# Altium schematic sheet Arc.SchDoc
size A4
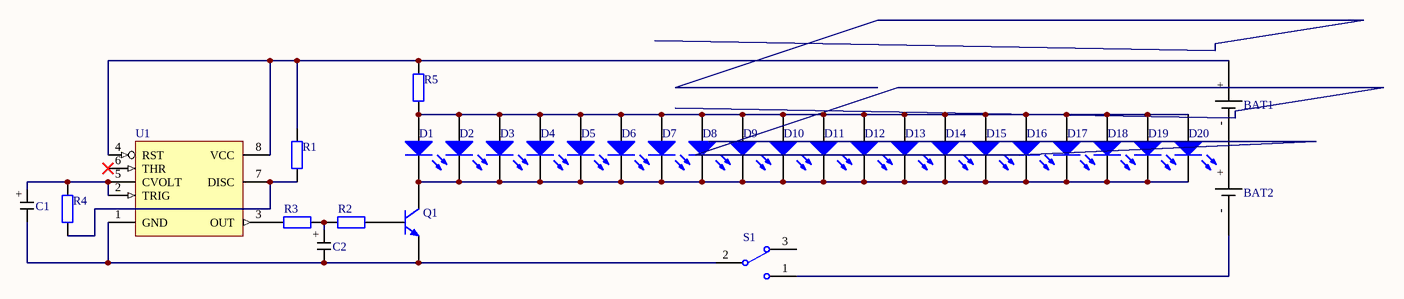
[diagram p0: Arc.SchDoc]

## Parts
BAT1  Power  [CR1220_Dock]  (value not drawn)
BAT2  Power  [CR1220_Dock]  (value not drawn)
C1  Cap  [*CAPCP3528X210N]  (value not drawn)
C2  Cap  [*CAPCP3528X210N]  (value not drawn)
D1  蓝灯 0603  [0603_LED_S1]  (value not drawn)
D2  蓝灯 0603  [0603_LED_S1]  (value not drawn)
D3  蓝灯 0603  [0603_LED_S1]  (value not drawn)
D4  蓝灯 0603  [0603_LED_S1]  (value not drawn)
D5  蓝灯 0603  [0603_LED_S1]  (value not drawn)
D6  蓝灯 0603  [0603_LED_S1]  (value not drawn)
D7  蓝灯 0603  [0603_LED_S1]  (value not drawn)
D8  蓝灯 0603  [0603_LED_S1]  (value not drawn)
D9  蓝灯 0603  [0603_LED_S1]  (value not drawn)
D10  蓝灯 0603  [0603_LED_S1]  (value not drawn)
D11  蓝灯 0603  [0603_LED_S1]  (value not drawn)
D12  蓝灯 0603  [0603_LED_S1]  (value not drawn)
D13  蓝灯 0603  [0603_LED_S1]  (value not drawn)
D14  蓝灯 0603  [0603_LED_S1]  (value not drawn)
D15  蓝灯 0603  [0603_LED_S1]  (value not drawn)
D16  蓝灯 0603  [0603_LED_S1]  (value not drawn)
D17  蓝灯 0603  [0603_LED_S1]  (value not drawn)
D18  蓝灯 0603  [0603_LED_S1]  (value not drawn)
D19  蓝灯 0603  [0603_LED_S1]  (value not drawn)
D20  蓝灯 0603  [0603_LED_S1]  (value not drawn)
Q1  SS8050 Y1  [SOT-23(SOT-23-3)]  (value not drawn)
R1  10KΩ (1002) ±1%  [0603_R]  (value not drawn)
R2  10KΩ (1002) ±1%  [0603_R]  (value not drawn)
R3  47KΩ (4702) ±1%  [0603_R]  (value not drawn)
R4  47KΩ (4702) ±1%  [0603_R]  (value not drawn)
R5  1.6k  [0603_R]  (value not drawn)
S1  SW-SPDT  [sw_9*3.5*5.5mm]  (value not drawn)
U1  NE555DR  [SOIC-8_150mil]  (value not drawn)

## Nets
NetBAT1_+: BAT1.+ R1.2 R5.2 U1.4(RST) U1.8(VCC)
NetBAT1_-: BAT1.- BAT2.+
NetBAT2_-: BAT2.- S1.1
NetC1_+: C1.+ R4.2 U1.2(TRIG) U1.5(CVOLT)
NetC1__: C1._ C2._ Q1.2(E) S1.2 U1.1(GND)
NetC2_+: C2.+ R2.2 R3.2
NetD1_A: D1.A D2.A D3.A D4.A D5.A D6.A D7.A D8.A D9.A D10.A D11.A D12.A D13.A D14.A D15.A D16.A D17.A D18.A D19.A D20.A R5.1
NetD1_K: D1.K D2.K D3.K D4.K D5.K D6.K D7.K D8.K D9.K D10.K D11.K D12.K D13.K D14.K D15.K D16.K D17.K D18.K D19.K D20.K Q1.3(C)
NetQ1_1: Q1.1(B) R2.1
NetR1_1: R1.1 R4.1 U1.7(DISC)
NetR3_1: R3.1 U1.3(OUT)

Not connected (* = marked no-connect by the designer): S1 3; U1 6(THR)*

## Library data of the parts
C1 C2 = Cap: pin to pad: +>1 _>2
D1-D20 = 0603 蓝灯: 发光二极管; ComponentLink1Description: 供应商链接; ComponentLink1URL: http://www.szlcsc.com/product/details_73150.html; Package: 0603; Supplier: LC; SuppliersPartNumber: C72041
Q1 = SOT-23 SS8050 Y1: 三极管; ComponentLink1Description: 供应商链接; ComponentLink1URL: http://www.szlcsc.com/product/details_2507.html; Package: SOT-23; Supplier: LC; SuppliersPartNumber: C2150
R1 R2 = 0603 10KΩ (1002) 1%: 贴片电阻; ComponentLink1Description: 供应商链接; ComponentLink1URL: http://www.szlcsc.com/product/details_26547.html; Package: 0603; Supplier: LC; SuppliersPartNumber: C25804
R3 R4 = 0603 47KΩ (4702) 1%: 贴片电阻; ComponentLink1Description: 供应商链接; ComponentLink1URL: http://www.szlcsc.com/product/details_26562.html; Package: 0603; Supplier: LC; SuppliersPartNumber: C25819
R5 = 0603 1.2KΩ (1201) 1%: 贴片电阻; ComponentLink1Description: 供应商链接; ComponentLink1URL: http://www.szlcsc.com/product/details_23492.html; Package: 0603; Supplier: LC; SuppliersPartNumber: C22765
S1 = SW-SPDT: SPDT Subminiature Toggle Switch, Right Angle Mounting, Vertical Actuation; Published: 24-Mar-1999; LatestRevisionDate: 17-Dec-2003; LatestRevisionNote: Schematic revised, PCB Footprint replaced.; DatasheetVersion: 05-Dec-2000; PackageReference: TL36WW15050; Publisher: Altium Limited; PackageDescription: Switch; 4 Leads; ComponentLink1Description: Manufacturer Link; ComponentLink1URL: http://www.apem.com
U1 = NE555DR_[C7593]: 时基集成; ComponentLink1Description: 供应商链接; ComponentLink1URL: http://www.szlcsc.com/product/details_8070.html; Package: SOIC-8_150mil; Supplier: LC; SuppliersPartNumber: C7593